# EAGLE schematic feszduplazo (EAGLE 6.4)
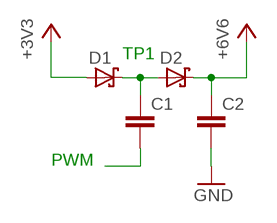
[diagram p0: schematic, sheet 1]

## Parts
C1  C-EU050-024X044  [C050-024X044]
C2  C-EU050-024X044  [C050-024X044]
D1  1N5817-B  [DO41-7.6]
D2  1N5817-B  [DO41-7.6]

## Nets
+3V3: D1.A
+5V: C2.1 D2.C ; supply symbol labelled +6V6
GND: C2.2
N$2: C1.1 D1.C D2.A
N$3: C1.2

## Notes on the sheet
- TP1
- PWM

## Library data of the parts
C1 C2 = rcl:C-EU: CAPACITOR, European symbol
D1 D2 = diode:1N581*: 1.0A SCHOTTKY BARRIER RECTIFIER Source: http://www.diodes.com/datasheets/ds23001.pdf